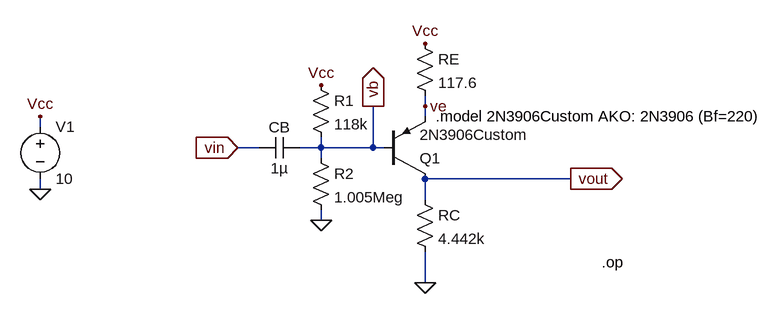
[diagram p0: schematic stage2.asc]
stage2.asc, the LTspice schematic file:
Version 4
SHEET 1 1220 680
WIRE 528 160 528 144
WIRE 528 176 528 160
WIRE -64 192 -64 176
WIRE 272 224 240 224
WIRE 368 224 368 208
WIRE 368 224 336 224
WIRE 448 224 448 160
WIRE 448 224 368 224
WIRE 464 224 448 224
WIRE 368 240 368 224
WIRE 752 272 528 272
WIRE -64 288 -64 272
WIRE 528 304 528 272
WIRE 368 336 368 320
WIRE 528 432 528 384
FLAG 368 336 0
FLAG 240 224 vin
IOPIN 240 224 In
FLAG 448 160 vb
IOPIN 448 160 Out
FLAG 528 160 ve
FLAG 368 128 Vcc
FLAG 528 64 Vcc
FLAG 752 272 vout
IOPIN 752 272 Out
FLAG 528 432 0
FLAG -64 288 0
FLAG -64 176 Vcc
SYMBOL Res 352 112 R0
SYMATTR InstName R1
SYMATTR Value 118k
SYMBOL Res 352 224 R0
SYMATTR InstName R2
SYMATTR Value 1.005Meg
SYMBOL Cap 336 208 R90
WINDOW 0 0 32 VBottom 2
WINDOW 3 32 32 VTop 2
SYMATTR InstName CB
SYMATTR Value 1µ
SYMBOL Res 512 48 R0
SYMATTR InstName RE
SYMATTR Value 117.6
SYMBOL Res 512 288 R0
SYMATTR InstName RC
SYMATTR Value 4.442k
SYMBOL pnp 464 272 M180
SYMATTR InstName Q1
SYMATTR Value 2N3906Custom
SYMBOL Voltage -64 176 R0
SYMATTR InstName V1
SYMATTR Value 10
TEXT 544 176 Left 2 !.model 2N3906Custom AKO: 2N3906 (Bf=220)
TEXT 800 400 Left 2 !.op

The netlist it stands for:
* stage2.asc
R1 Vcc vb 118k
R2 vb 0 1.005Meg
CB vb vin 1µ
RE Vcc ve 117.6
RC vout 0 4.442k
Q1 vout vb ve 0 2N3906Custom
V1 Vcc 0 10
.model NPN NPN
.model PNP PNP
.lib standard.bjt
.model 2N3906Custom AKO: 2N3906 (Bf=220)
.op
.backanno
.end